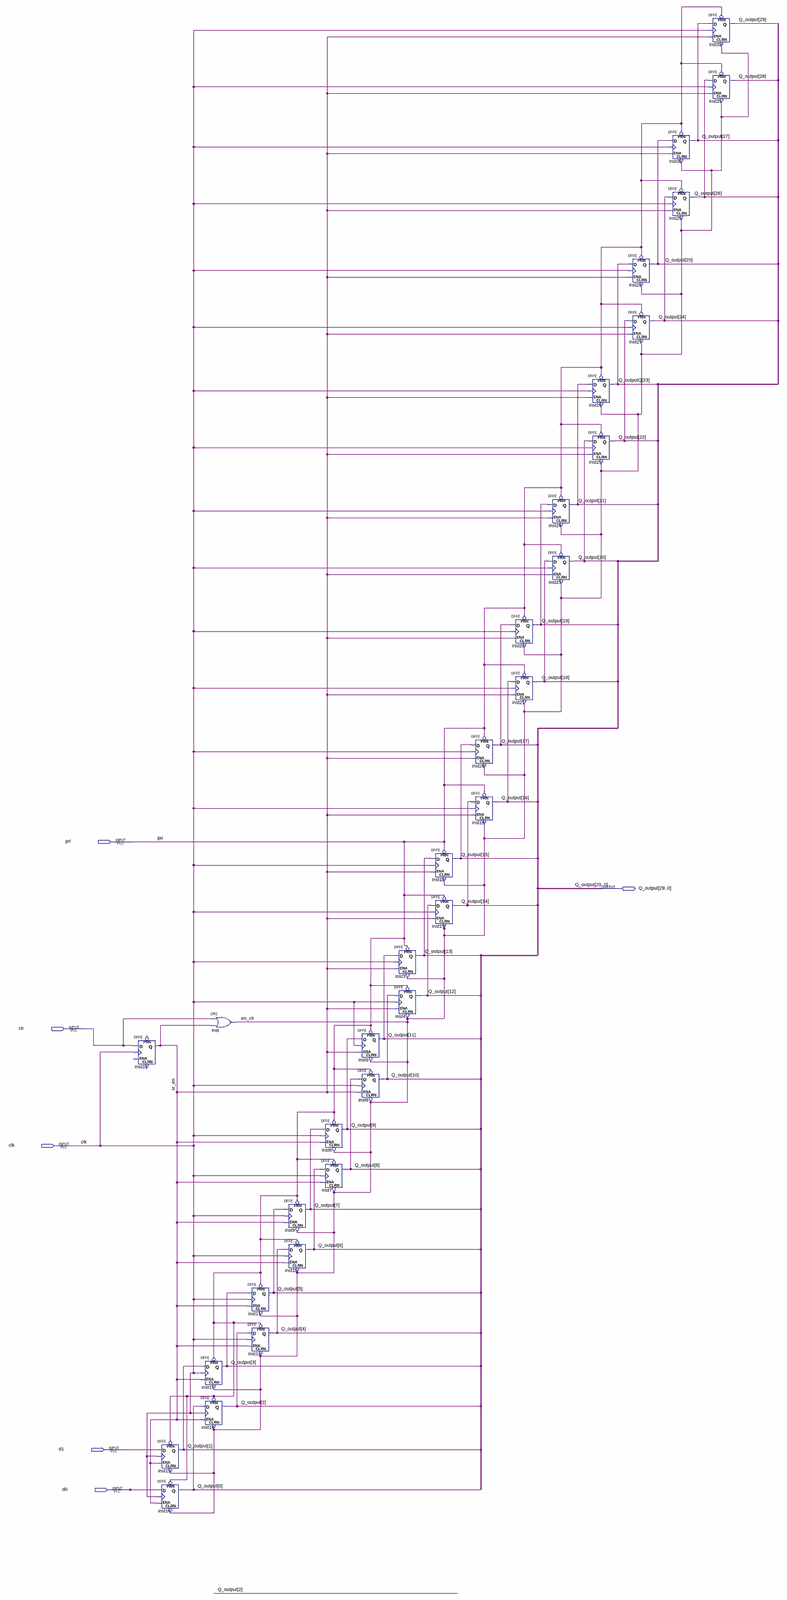
[diagram p0: schematic sheet, whole]
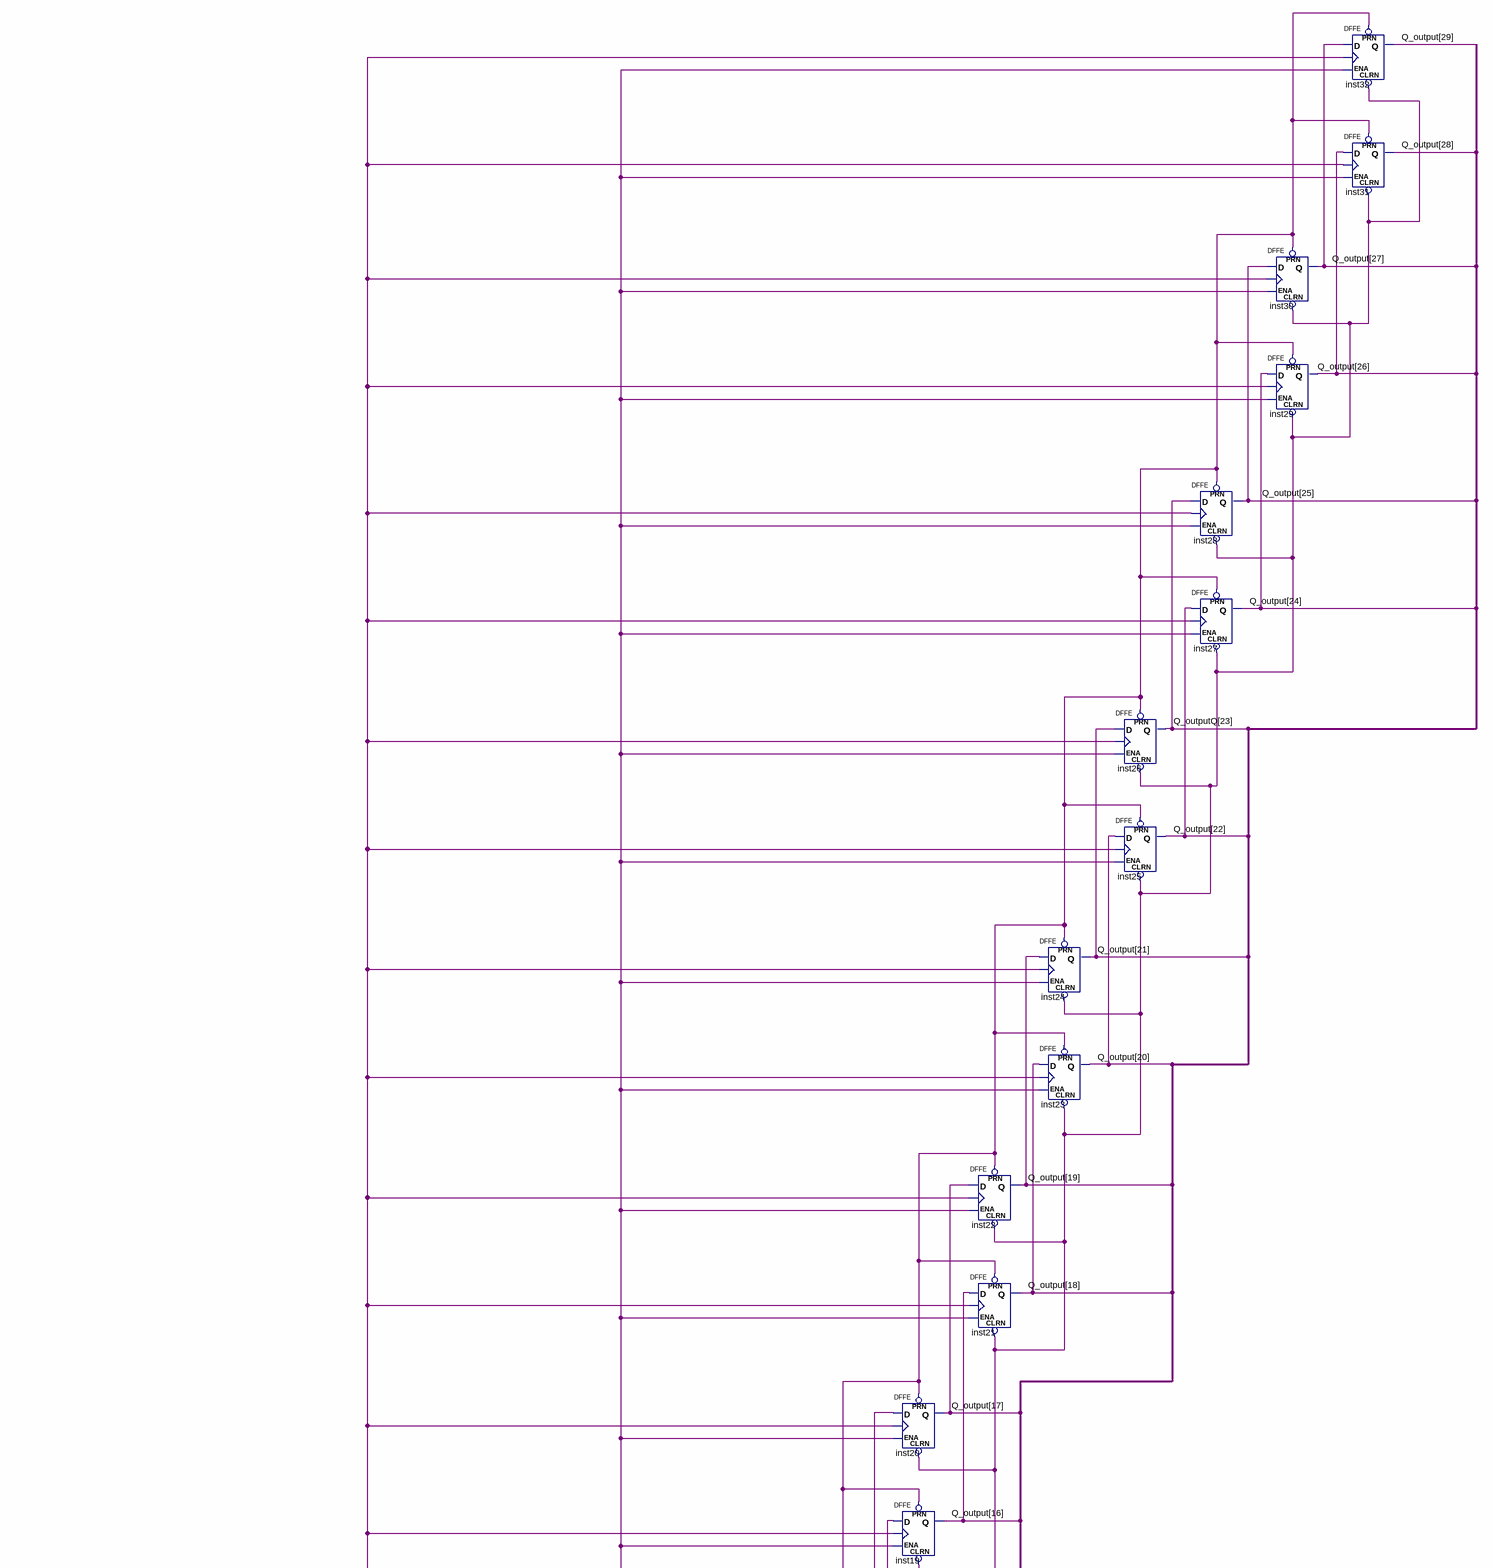
[diagram p1: schematic sheet, upper part]
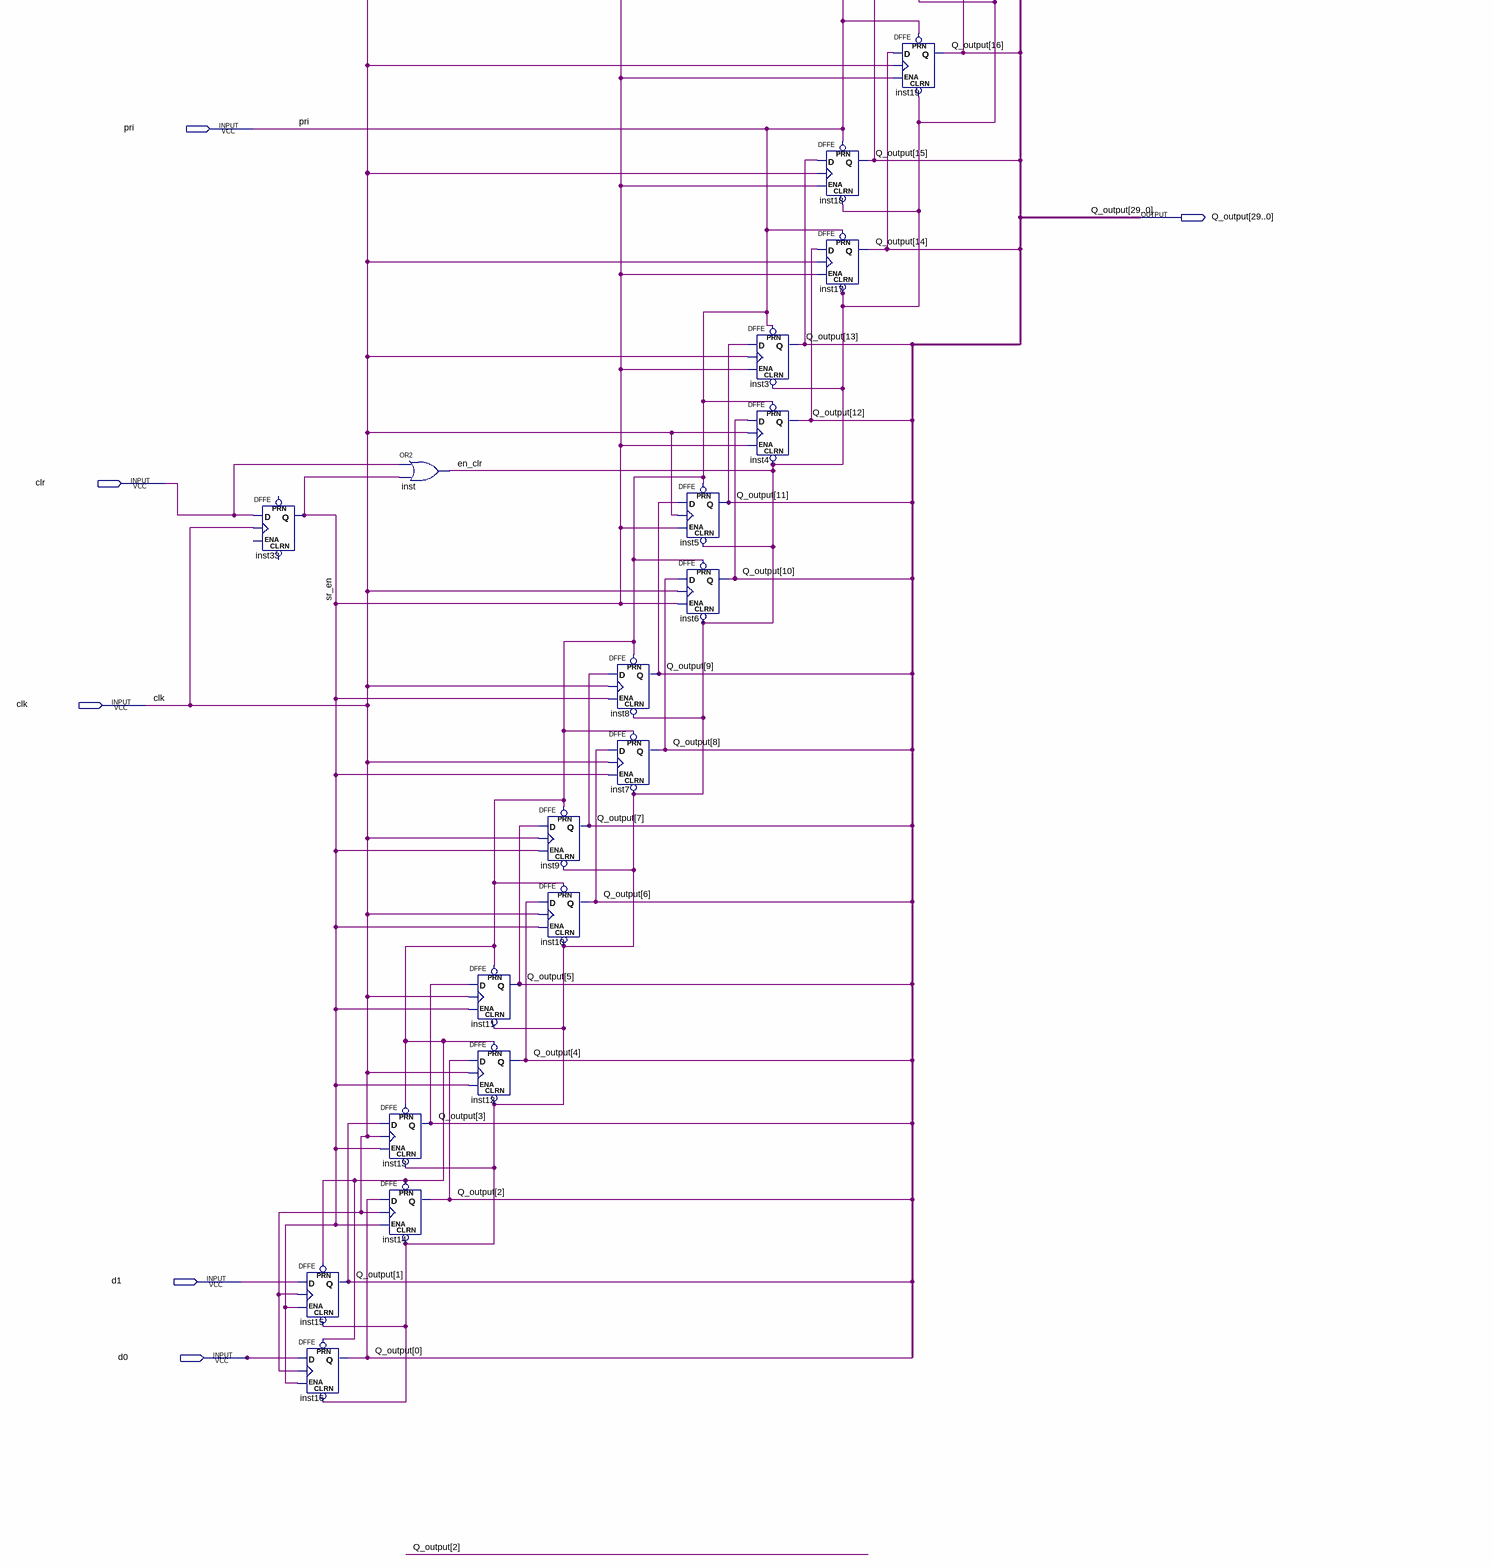
[diagram p2: schematic sheet, lower part]
// Quartus schematic Shift_register_30bit.bdf as structural Verilog: 32 symbols, 6 pins
module Shift_register_30bit (
  input  pri,
  input  clr,
  input  clk,
  input  d1,
  input  d0,
  output [29:0] Q_output
);

  wire en_clr, sr_en;
  wire [23:23] Q_outputQ;

  DFFE inst33 (.D(clr), .CLK(clk), .Q(sr_en));  // open: PRN, CLRN, ENA
  DFFE inst15 (.PRN(pri), .CLRN(en_clr), .D(d1), .CLK(clk), .ENA(sr_en), .Q(Q_output[1]));
  DFFE inst16 (.PRN(pri), .CLRN(en_clr), .D(d0), .CLK(clk), .ENA(sr_en), .Q(Q_output[0]));
  DFFE inst13 (.PRN(pri), .CLRN(en_clr), .D(Q_output[1]), .CLK(clk), .ENA(sr_en), .Q(Q_output[3]));
  DFFE inst14 (.PRN(pri), .CLRN(en_clr), .D(Q_output[0]), .CLK(clk), .ENA(sr_en), .Q(Q_output[2]));
  or inst (en_clr, clr, sr_en);
  DFFE inst11 (.PRN(pri), .CLRN(en_clr), .D(Q_output[3]), .CLK(clk), .ENA(sr_en), .Q(Q_output[5]));
  DFFE inst12 (.PRN(pri), .CLRN(en_clr), .D(Q_output[2]), .CLK(clk), .ENA(sr_en), .Q(Q_output[4]));
  DFFE inst9 (.PRN(pri), .CLRN(en_clr), .D(Q_output[5]), .CLK(clk), .ENA(sr_en), .Q(Q_output[7]));
  DFFE inst10 (.PRN(pri), .CLRN(en_clr), .D(Q_output[4]), .CLK(clk), .ENA(sr_en), .Q(Q_output[6]));
  DFFE inst8 (.PRN(pri), .CLRN(en_clr), .D(Q_output[7]), .CLK(clk), .ENA(sr_en), .Q(Q_output[9]));
  DFFE inst7 (.PRN(pri), .CLRN(en_clr), .D(Q_output[6]), .CLK(clk), .ENA(sr_en), .Q(Q_output[8]));
  DFFE inst5 (.PRN(pri), .CLRN(en_clr), .D(Q_output[9]), .CLK(clk), .ENA(sr_en), .Q(Q_output[11]));
  DFFE inst6 (.PRN(pri), .CLRN(en_clr), .D(Q_output[8]), .CLK(clk), .ENA(sr_en), .Q(Q_output[10]));
  DFFE inst3 (.PRN(pri), .CLRN(en_clr), .D(Q_output[11]), .CLK(clk), .ENA(sr_en), .Q(Q_output[13]));
  DFFE inst4 (.PRN(pri), .CLRN(en_clr), .D(Q_output[10]), .CLK(clk), .ENA(sr_en), .Q(Q_output[12]));
  DFFE inst18 (.PRN(pri), .CLRN(en_clr), .D(Q_output[13]), .CLK(clk), .ENA(sr_en), .Q(Q_output[15]));
  DFFE inst17 (.PRN(pri), .CLRN(en_clr), .D(Q_output[12]), .CLK(clk), .ENA(sr_en), .Q(Q_output[14]));
  DFFE inst20 (.PRN(pri), .CLRN(en_clr), .D(Q_output[15]), .CLK(clk), .ENA(sr_en), .Q(Q_output[17]));
  DFFE inst19 (.PRN(pri), .CLRN(en_clr), .D(Q_output[14]), .CLK(clk), .ENA(sr_en), .Q(Q_output[16]));
  DFFE inst22 (.PRN(pri), .CLRN(en_clr), .D(Q_output[17]), .CLK(clk), .ENA(sr_en), .Q(Q_output[19]));
  DFFE inst21 (.PRN(pri), .CLRN(en_clr), .D(Q_output[16]), .CLK(clk), .ENA(sr_en), .Q(Q_output[18]));
  DFFE inst24 (.PRN(pri), .CLRN(en_clr), .D(Q_output[19]), .CLK(clk), .ENA(sr_en), .Q(Q_output[21]));
  DFFE inst23 (.PRN(pri), .CLRN(en_clr), .D(Q_output[18]), .CLK(clk), .ENA(sr_en), .Q(Q_output[20]));
  DFFE inst26 (.PRN(pri), .CLRN(en_clr), .D(Q_output[21]), .CLK(clk), .ENA(sr_en), .Q(Q_outputQ[23]));
  DFFE inst25 (.PRN(pri), .CLRN(en_clr), .D(Q_output[20]), .CLK(clk), .ENA(sr_en), .Q(Q_output[22]));
  DFFE inst28 (.PRN(pri), .CLRN(en_clr), .D(Q_outputQ[23]), .CLK(clk), .ENA(sr_en), .Q(Q_output[25]));
  DFFE inst27 (.PRN(pri), .CLRN(en_clr), .D(Q_output[22]), .CLK(clk), .ENA(sr_en), .Q(Q_output[24]));
  DFFE inst30 (.PRN(pri), .CLRN(en_clr), .D(Q_output[25]), .CLK(clk), .ENA(sr_en), .Q(Q_output[27]));
  DFFE inst29 (.PRN(pri), .CLRN(en_clr), .D(Q_output[24]), .CLK(clk), .ENA(sr_en), .Q(Q_output[26]));
  DFFE inst32 (.PRN(pri), .CLRN(en_clr), .D(Q_output[27]), .CLK(clk), .ENA(sr_en), .Q(Q_output[29]));
  DFFE inst31 (.PRN(pri), .CLRN(en_clr), .D(Q_output[26]), .CLK(clk), .ENA(sr_en), .Q(Q_output[28]));
endmodule
